# Altium project CT.PrjPCB
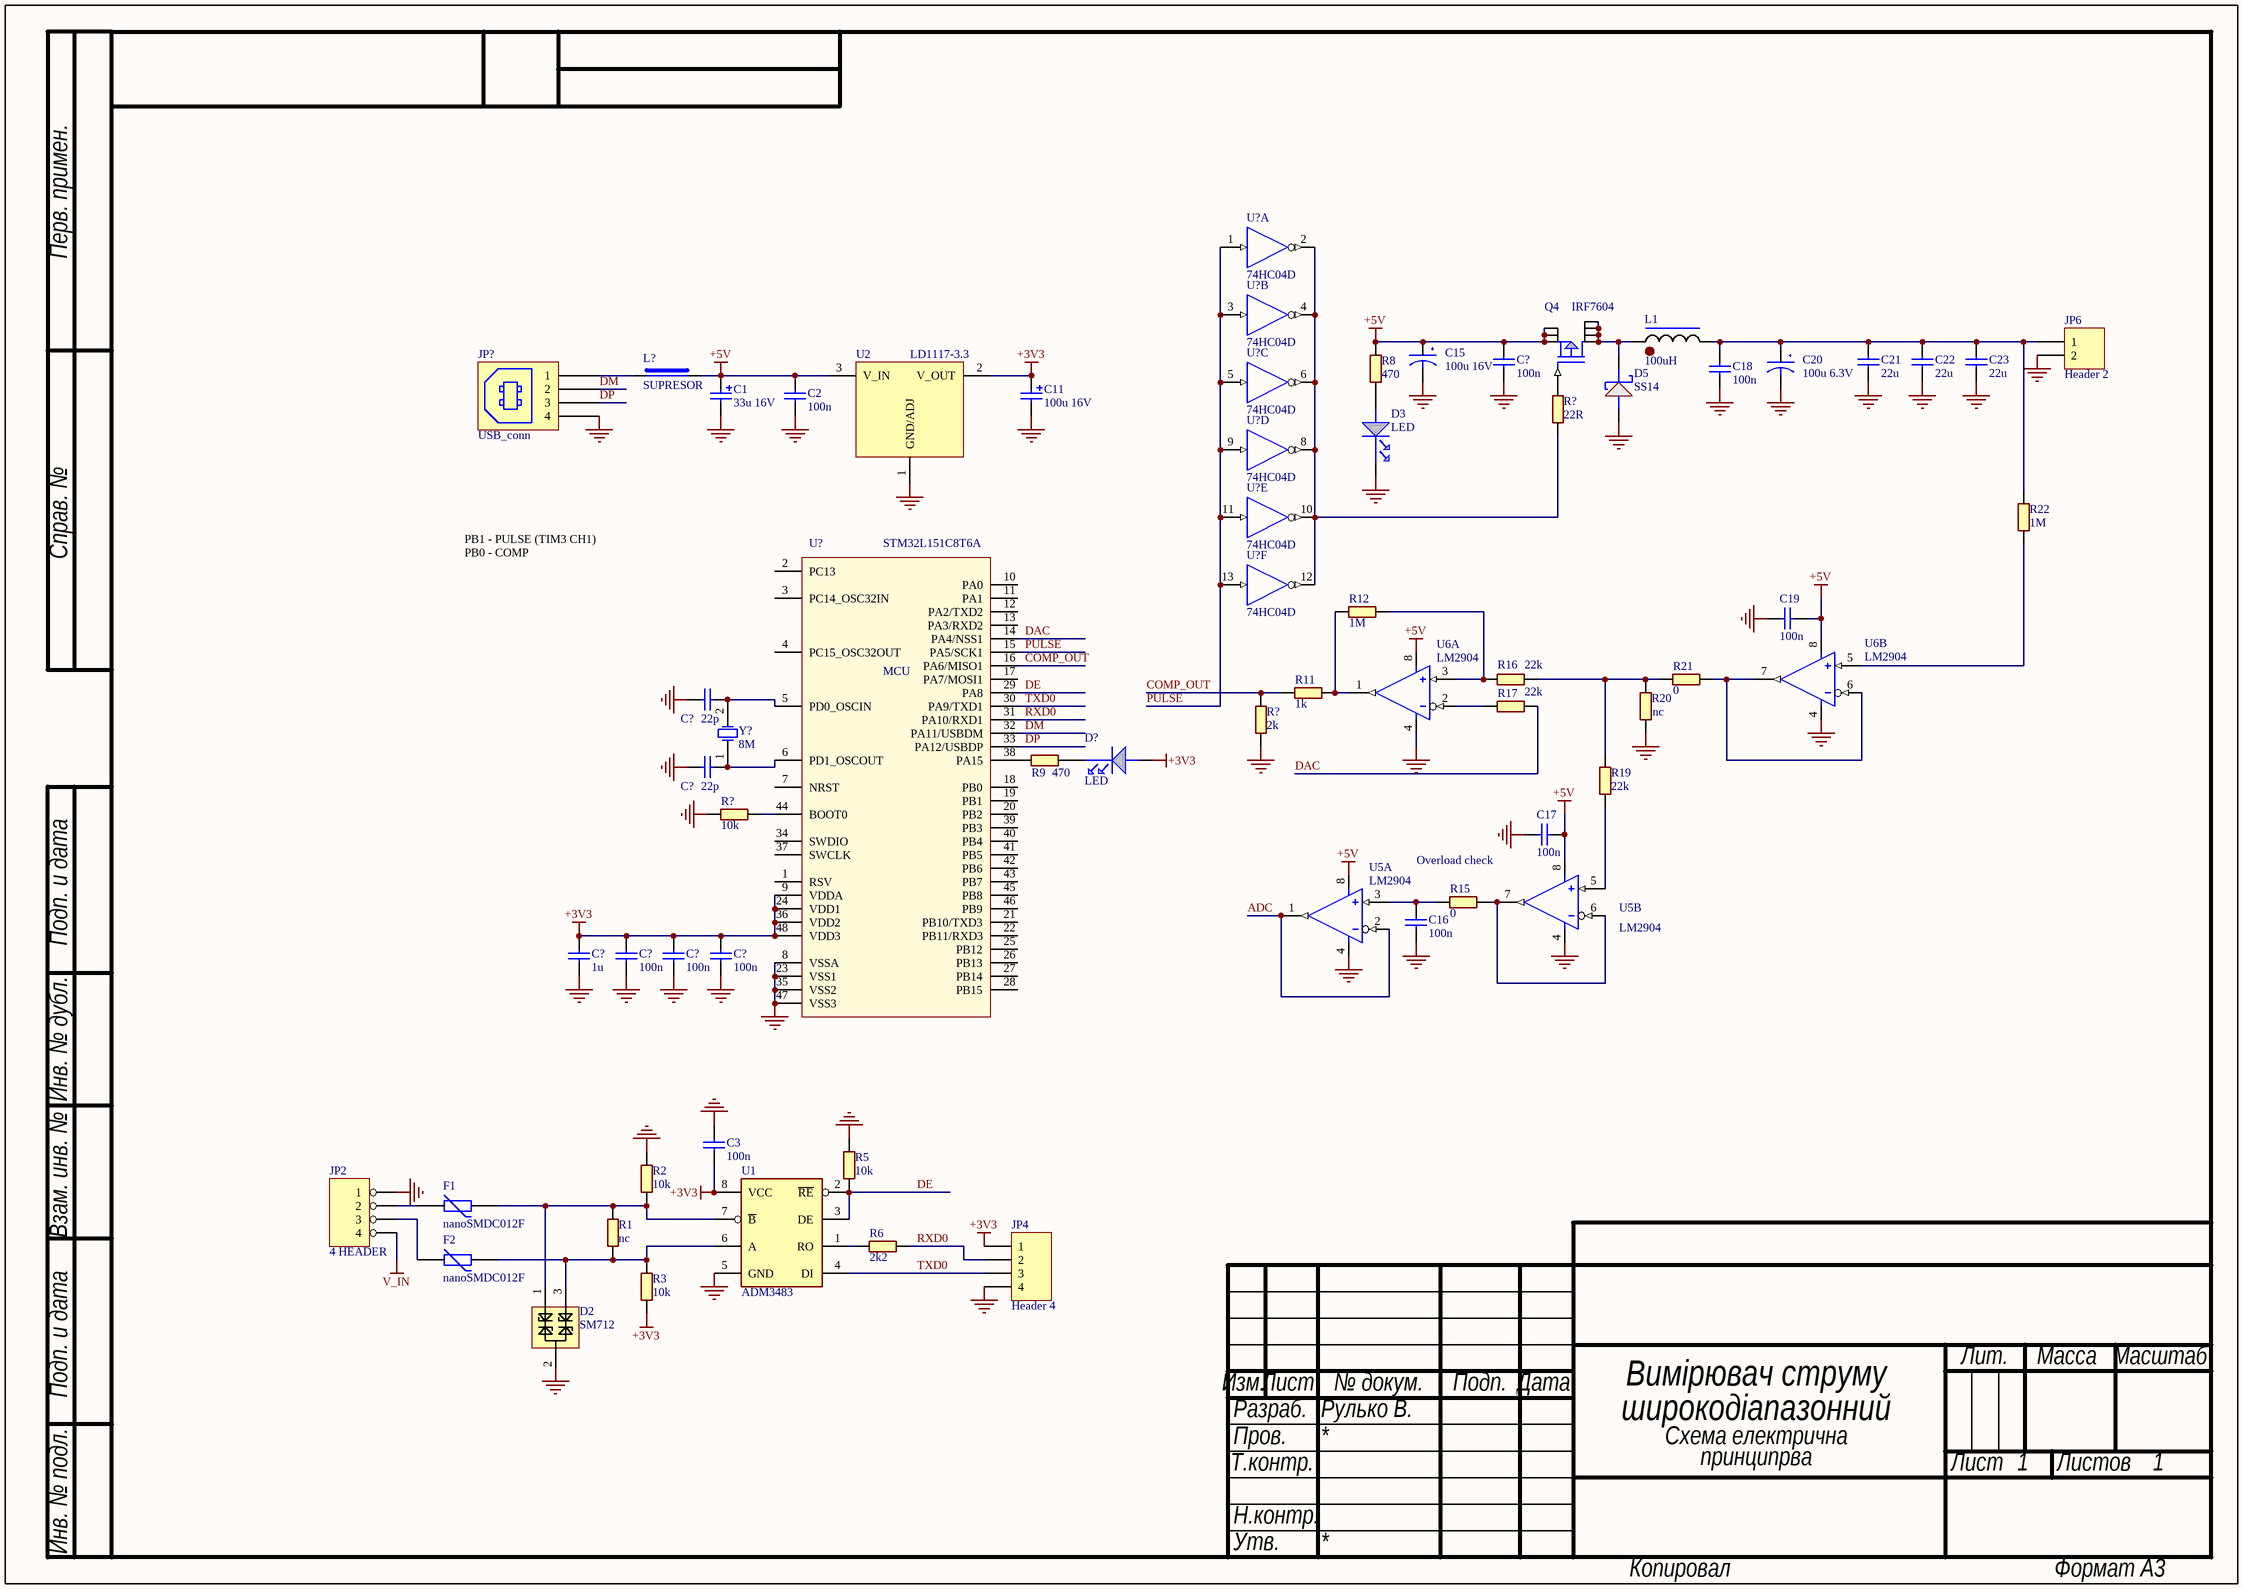
[diagram p0: CT_USB.SchDoc]
DeviceName: WCM; ProjectNameForBom: Вимірювач струму широкодіапазонний; RevisionDateForBOM: =CurrentDate; version: v1.2
1 sheet, 64 parts. Net scope: global (net labels, ports and power ports of the same name join across sheets).
Board file: CT_USB.PcbDoc

## Sheet CT_USB.SchDoc
size 420 x 297 mm; DrawnBy: Рулько В.; DocumentNumber: WCM v1.2; SheetNumber: 1; SheetTotal: 1; Title1str: Вимірювач струму; PageSetup: Record=PageOptions|CenterHorizontal=False|CenterVertical=False|PrintScale=0.95|XCorrection=0.00|YCorrection=0.00|PrintKind=1|BorderSize=5000000|LeftOffset=0|BottomOffset=0|Orientation=1|PaperLength=1000|PaperWidth=1000|Scale=100|PaperSource=15|PrintQuality=600|MediaType=1|DitherType=10|PaperKind=A4|PrintScaleMode=1; Title2str: широкодіапазонний; DocumentType1str: Схема електрична; DocumentType2str: принципрва; ProjectNameForBOM: Вимірювач струму широкодіапазонний

### Parts
(Parts that share a designator on the sheet are numbered #1, #2 ... from top to bottom, then left to right.)
C1  33u 16V  [C_TANTAL_D]
C2  100n  [C-0603]
C3  100n  [C-0603]
C11  100u 16V  [C_TANTAL_D]
C15  100u 16V  [C_TANTAL_D]
C16  100n  [C-0603]
C17  100n  [C-0603]
C18  100n  [C-0603]
C19  100n  [C-0603]
C20  100u 6.3V  [C_TANTAL_B]
C21  22u  [C-1206]
C22  22u  [C-1206]
C23  22u  [C-1206]
C?#1  100n  [C-0603]
C?#2  22p  [C-0603]
C?#3  22p  [C-0603]
C?#4  1u  [C-0603]
C?#5  100n  [C-0603]
C?#6  100n  [C-0603]
C?#7  100n  [C-0603]
D2  SM712  [SOT-23]
D3  LED  [LED_0805]
D5  SS14  [D-SMA]
D?  LED  [LED_0805]
F1  nanoSMDC012F  [R-1206]
F2  nanoSMDC012F  [R-1206]
JP2  4 HEADER  [TERMINAL4_3]
JP4  Header 4  [PLS1-4]
JP6  Header 2  [TERMINAL2_1]
JP?  USB_conn  [USB_A_M]
L1  100uH  [SND-0705_3]
L?  SUPRESOR  [L-1210]
Q4  IRF7604  [SSOP-8]
R1  nc  [R-0603]
R2  10k  [R-0603]
R3  10k  [R-0603]
R5  10k  [R-0603]
R6  2k2  [R-0603]
R8  470  [R-0603]
R9  470  [R-0603]
R11  1k  [R-0603]
R12  1M  [R-0603]
R15  0  [R-0603]
R16  22k  [R-0603]
R17  22k  [R-0603]
R19  22k  [R-0603]
R20  nc  [R-0603]
R21  0  [R-0603]
R22  1M  [R-0603]
R?#1  22R  [R-0603]
R?#2  2k  [R-0603]
R?#3  10k  [R-0603]
U1  ADM3483  [SO-8]
U2  LD1117-3.3  [SOT223]
U5  LM2904  [SO-8]  (parts A,B of 2)
U6  LM2904  [SO-8]  (parts A,B of 2)
U?#1  74HC04D  [SO14-(SOT-108-1)]  (part A of 6)
U?#2  74HC04D  [SO14-(SOT-108-1)]  (part B of 6)
U?#3  74HC04D  [SO14-(SOT-108-1)]  (part C of 6)
U?#4  74HC04D  [SO14-(SOT-108-1)]  (part D of 6)
U?#5  74HC04D  [SO14-(SOT-108-1)]  (part E of 6)
U?#6  74HC04D  [SO14-(SOT-108-1)]  (part F of 6)
U?#7  STM32L151C8T6A  [LQFP-48]
Y?  8M  [HC49_3.5mm]

### Nets
+3V3: C3.2 C11.2 C?#4.1 C?#5.1 C?#6.1 C?#7.1 D?.A(ANODE) JP4.1 R3.2 U1.8(VCC) U2.2(V_OUT) U?#7.9(VDDA) U?#7.24(VDD1) U?#7.36(VDD2) U?#7.48(VDD3)
+5V: C1.2 C2.1 C15.2(+) C17.2 C19.2 C?#1.1 L?.2 Q4.1(SOURCE) Q4.2(SOURCE) Q4.3(SOURCE) R8.1 U2.3(V_IN) U5.8(V+) U6.8(V+)
GND: C1.1 C2.2 C3.1 C11.1 C15.1(-) C16.2 C17.1 C18.2 C19.1 C20.1(-) C21.2 C22.2 C23.2 C?#1.2 C?#2.1 C?#3.1 C?#4.2 C?#5.2 C?#6.2 C?#7.2 D2.2 D3.K(CATHODE) D5.A JP2.1 JP4.4 JP6.2 JP?.4 R2.2 R5.1 R20.2 R?#2.2 R?#3.1 U1.5(GND) U2.1(GND/ADJ) U5.4(V-) U6.4(V-) U?#7.8(VSSA) U?#7.23(VSS1) U?#7.35(VSS2) U?#7.47(VSS3)
GND-D: U?#1.7(GND) U?#2.7(GND) U?#3.7(GND) U?#4.7(GND-D) U?#5.7(GND-D) U?#6.7(GND-D)
V_IN: JP2.4
VCC: U?#1.14(+5V) U?#2.14(+5V) U?#3.14(+5V) U?#4.14(+5V) U?#5.14(VCC) U?#6.14(VCC)
ADC: U5.1(OUT) U5.2(-IN)
COMP_OUT: R11.2 R?#2.1 U?#7.16(PA6/MISO1)
DAC: R17.1 U?#7.14(PA4/NSS1)
DE: R5.2 U1.2(~{RE}) U1.3(DE) U?#7.29(PA8)
DM: JP?.2 U?#7.32(PA11/USBDM)
DP: JP?.3 U?#7.33(PA12/USBDP)
PULSE: U?#1.1(A) U?#2.3(A) U?#3.5(A) U?#4.9(A) U?#5.11(A) U?#6.13(A) U?#7.15(PA5/SCK1)
RXD0: JP4.2 R6.1 U?#7.31(PA10/RXD1)
TXD0: JP4.3 U1.4(DI) U?#7.30(PA9/TXD1)
NetC16_1: C16.1 R15.2 U5.3(+IN)
NetC18_1: C18.1 C20.2(+) C21.1 C22.1 C23.1 JP6.1 L1.2 R22.2
NetC?#2_2: C?#2.2 U?#7.5(PD0_OSCIN) Y?.2(OSC2)
NetC?#3_2: C?#3.2 U?#7.6(PD1_OSCOUT) Y?.1(OSC1)
NetD2_1: D2.1 F1.2 R1.1 R2.1 U1.7(~{B})
NetD2_3: D2.3 F2.2 R1.2 R3.1 U1.6(A)
NetD3_A: D3.A(ANODE) R8.2
NetD5_K: D5.K L1.1 Q4.5(DRAIN) Q4.6(DRAIN) Q4.7(DRAIN) Q4.8(DRAIN)
NetD?_K: D?.K(CATHODE) R9.2
NetF1_1: F1.1 JP2.2
NetF2_1: F2.1 JP2.3
NetJP?_1: JP?.1 L?.1
NetQ4_4: Q4.4(GATE) R?#1.1
NetR6_2: R6.2 U1.1(RO)
NetR9_1: R9.1 U?#7.38(PA15)
NetR11_1: R11.1 R12.2 U6.1(OUT)
NetR12_1: R12.1 R16.2 U6.3(+IN)
NetR15_1: R15.1 U5.6(-IN) U5.7(OUT)
NetR16_1: R16.1 R19.1 R20.1 R21.2
NetR17_2: R17.2 U6.2(-IN)
NetR19_2: R19.2 U5.5(+IN)
NetR21_1: R21.1 U6.6(-IN) U6.7(OUT)
NetR22_1: R22.1 U6.5(+IN)
NetR?#1_2: R?#1.2 U?#1.2(Y) U?#2.4(Y) U?#3.6(Y) U?#4.8(Y) U?#5.10(Y) U?#6.12(Y)
NetR?#3_2: R?#3.2 U?#7.44(BOOT0)

Not connected (* = marked no-connect by the designer): U?#7 1(RSV) 2(PC13) 3(PC14_OSC32IN) 4(PC15_OSC32OUT) 7(NRST) 10(PA0) 11(PA1) 12(PA2/TXD2) 13(PA3/RXD2) 17(PA7/MOSI1) 18(PB0) 19(PB1) 20(PB2) 21(PB10/TXD3) 22(PB11/RXD3) 25(PB12) 26(PB13) 27(PB14) 28(PB15) 34(SWDIO) 37(SWCLK) 39(PB3) 40(PB4) 41(PB5) 42(PB6) 43(PB7) 45(PB8) 46(PB9)

### Notes on the sheet
- PB1 - PULSE (TIM3 CH1)
  PB0 - COMP
- Overload check
- Перв. примен.
- Справ. №
- Подп. и дата
- Инв. № дубл.
- Взам. инв. №
- Изм.
- Лист
- № докум.
- Подп.
- Дата
- Лит.
- Масса
- Масштаб
- Т.контр.
- Пров.
- Разраб.
- Листов
- Инв. № подл.
- Н.контр.
- Утв.
- Копировал
- Формат А3
- (in symbol STM32L151C8T6) MCU

### Library data of the parts
C1 C11 = CAPP: Вид: Конденсатор; Корпус: C_TANTAL_D
  C1: Номінал: 33u 16V
  C11: Номінал: 100u 16V
C2 C3 C16-C19 C21-C23 C?#1 C?#4-C?#7 = CAPN: Вид: Конденсатор; Точність/група: X7R
  C2: Номінал: 100n; Корпус: C-0603
  C3 C16-C19 C?#1 C?#5-C?#7: Корпус: C-0603; Номінал: 100n
  C21-C23: Корпус: C-1206; Номінал: 22u
  C?#4: Корпус: C-0603; Номінал: 1u
C15 C20 = C-EL-DIP: Вид: Конденсатор; Точність/група: *
  C15: Корпус: C_TANTAL_D; Номінал: 100u 16V
  C20: Корпус: C_TANTAL_B; Номінал: 100u 6.3V
C?#2 C?#3 = CAPN: Вид: Конденсатор; Точність/група: NP0; Корпус: C-0603; Номінал: 22p
D2 = SM712: Вид: Діод; Корпус: SOT-23; Номінал: SM712
D3 D? = LED: Вид: Діод; Корпус: LED_0805; Номінал: LED
D5 = DIODE SCHOTTKY: Вид: Діод; Корпус: D-SMA; Номінал: SS14
F1 F2 = VARISTOR: Вид: Термозапобіжник; Корпус: R-1206; Номінал: nanoSMDC012F
JP2 = 4 HEADER: 4 Pin Header; Вид: Роз'єм; *: *; Корпус: TERMINAL4_3; Номінал: 4 HEADER
JP4 = Header 4: Header, 4-Pin; Вид: Роз'єм; Корпус: PLS1-4; Номінал: Header 4
JP6 = Header 2: Header, 2-Pin; Вид: Роз'єм; Корпус: TERMINAL2_1; Номінал: Header 2
JP? = USB_conn: USB_connector
L1 = L*: Вид: Індуктивність; Корпус: SND-0705_3; Номінал: 100uH
Q4 = MOSFET_P_8pins: Вид: Транзистор; Корпус: SSOP-8; Номінал: IRF7604
R1-R3 R5 R6 R8 R9 R11 R12 R15-R17 R19-R22 R?#1-R?#3 = RES: Вид: Резистор; Точність/група: 5%; Корпус: R-0603
  R1 R20: Номінал: nc
  R2 R3 R5 R?#3: Номінал: 10k
  R6: Номінал: 2k2
  R8 R9: Номінал: 470
  R11: Номінал: 1k
  R12 R22: Номінал: 1M
  R15 R21: Номінал: 0
  R16 R17 R19: Номінал: 22k
  R?#1: Номінал: 22R
  R?#2: Номінал: 2k
U1 = SN65HVD12DG4: Вид: Мікросхема; Корпус: SO-8; Номінал: ADM3483
U2 = LM1117_3.3: Вид: Мікросхема; Номінал: LD1117-3.3; Корпус: SOT223
U5 U6 = LM2904: 2 Operation amplifier; Вид: Мікросхема; Корпус: SO-8; Номінал: LM2904
U?#1-U?#6 = 74HC04D: Hex Inverter; Производитель: *; Допустимая замена: *; Цена: *; PDF файл: *
U?#7 = STM32L151C8T6
Y? = XTAL: Crystal Oscillator; Вид: Кварц; Корпус: HC49_3.5mm; Номінал: 8M
L? = SUPRESOR: Примечание: *; Производитель: *